# Altium schematic sheet Sheet3.SchDoc
size A
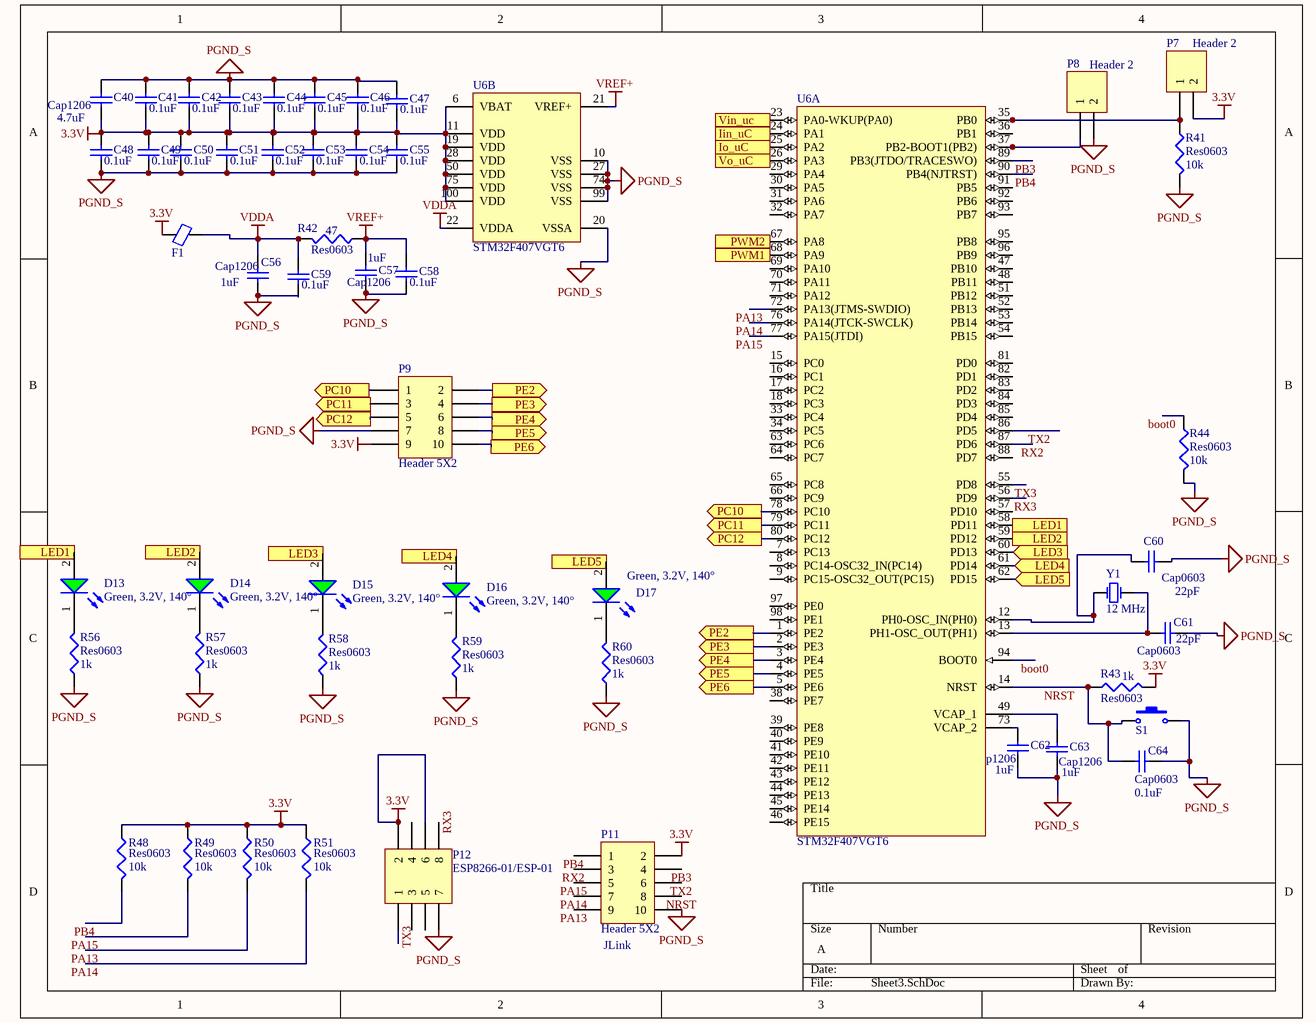
[diagram p0: Sheet3.SchDoc]

## Parts
C40  Cap1206  value 4.7uF  [C1206]
C41  value 0.1uF  [1608[0603]]  (hidden comment: Cap0603)
C42  value 0.1uF  [1608[0603]]  (hidden comment: Cap0603)
C43  value 0.1uF  [1608[0603]]  (hidden comment: Cap0603)
C44  value 0.1uF  [1608[0603]]  (hidden comment: Cap0603)
C45  value 0.1uF  [1608[0603]]  (hidden comment: Cap0603)
C46  value 0.1uF  [1608[0603]]  (hidden comment: Cap0603)
C47  value 0.1uF  [1608[0603]]  (hidden comment: Cap0603)
C48  value 0.1uF  [1608[0603]]  (hidden comment: Cap0603)
C49  value 0.1uF  [1608[0603]]  (hidden comment: Cap0603)
C50  value 0.1uF  [1608[0603]]  (hidden comment: Cap0603)
C51  value 0.1uF  [1608[0603]]  (hidden comment: Cap0603)
C52  value 0.1uF  [1608[0603]]  (hidden comment: Cap0603)
C53  value 0.1uF  [1608[0603]]  (hidden comment: Cap0603)
C54  value 0.1uF  [1608[0603]]  (hidden comment: Cap0603)
C55  value 0.1uF  [1608[0603]]  (hidden comment: Cap0603)
C56  Cap1206  value 1uF  [C1206]
C57  Cap1206  value 1uF  [C1206]
C58  value 0.1uF  [1608[0603]]  (hidden comment: Cap0603)
C59  value 0.1uF  [1608[0603]]  (hidden comment: Cap0603)
C60  Cap0603  value 22pF  [1608[0603]]
C61  Cap0603  value 22pF  [1608[0603]]
C62  Cap1206  value 1uF  [C1206]
C63  Cap1206  value 1uF  [C1206]
C64  Cap0603  value 0.1uF  [1608[0603]]
D13  Green, 3.2V, 140°  [WL-SMCW_0805_150080xx75000]
D14  Green, 3.2V, 140°  [WL-SMCW_0805_150080xx75000]
D15  Green, 3.2V, 140°  [WL-SMCW_0805_150080xx75000]
D16  Green, 3.2V, 140°  [WL-SMCW_0805_150080xx75000]
D17  Green, 3.2V, 140°  [WL-SMCW_0805_150080xx75000]
F1  Ferrite Bead SMD  [FB0805]  (value not drawn)
P7  Header 2  [HDR1X2]
P8  Header 2  [HDR1X2]
P9  Header 5X2  [HDR2X5]
P11  Header 5X2  [HDR2X5]
P12  ESP8266-01/ESP-01  [HDR2X4]
R41  Res0603  value 10k  [J1-0603]
R42  Res0603  value 47  [J1-0603]
R43  Res0603  value 1k  [J1-0603]
R44  Res0603  value 10k  [J1-0603]
R48  Res0603  value 10k  [J1-0603]
R49  Res0603  value 10k  [J1-0603]
R50  Res0603  value 10k  [J1-0603]
R51  Res0603  value 10k  [J1-0603]
R56  Res0603  value 1k  [J1-0603]
R57  Res0603  value 1k  [J1-0603]
R58  Res0603  value 1k  [J1-0603]
R59  Res0603  value 1k  [J1-0603]
R60  Res0603  value 1k  [J1-0603]
S1  Switch PB  [SW-PB]  (value not drawn)
U6  STM32F407VGT6  [STM-LQFP100_N]  (parts A,B of 2)
Y1  12 MHz  [XTAL 16MHZ]

## Ports
Iin_uC (in), Io_uC (in), LED1 (in), LED2 (in), LED3 (in), LED4 (in), LED5 (in), PC10 (out), PC11 (out), PC12 (out), PE2 (out), PE3 (out), PE4 (out), PE5 (out), PE6 (out), PWM1 (in), PWM2 (in), Vin_uc (in), Vo_uC (in)

## Nets
3.3V: C40.2 C41.2 C42.2 C43.2 C44.2 C45.2 C46.2 C47.2 C48.1 C49.1 C50.1 C51.1 C52.1 C53.1 C54.1 C55.1 F1.1 P7.2 P9.9 P11.2 P12.2 P12.6 R43.2 R48.1 R49.1 R50.1 R51.1 U6.6(VBAT) U6.11(VDD) U6.19(VDD) U6.28(VDD) U6.50(VDD) U6.75(VDD) U6.100(VDD)
PGND_S: C40.1 C41.1 C42.1 C43.1 C44.1 C45.1 C46.1 C47.1 C48.2 C49.2 C50.2 C51.2 C52.2 C53.2 C54.2 C55.2 C56.2 C57.2 C58.2 C59.2 C60.1 C61.1 C62.1 C63.1 C64.1 P8.2 P9.7 P11.10 P12.7 R41.2 R44.2 R56.1 R57.1 R58.1 R59.1 R60.1 S1.2 U6.10(VSS) U6.20(VSSA) U6.27(VSS) U6.74(VSS) U6.99(VSS)
VDDA: C56.1 C59.1 F1.2 R42.2 U6.22(VDDA)
VREF+: C57.1 C58.1 R42.1 U6.21(VREF+)
boot0: R44.1 U6.94(BOOT0)
Iin_uC: U6.24(PA1) ; port Iin_uC
Io_uC: U6.25(PA2) ; port Io_uC
LED1: D13.2(A) U6.58(PD11) ; port LED1
LED2: D14.2(A) U6.59(PD12) ; port LED2
LED3: D15.2(A) U6.60(PD13) ; port LED3
LED4: D16.2(A) U6.61(PD14) ; port LED4
LED5: D17.2(A) U6.62(PD15) ; port LED5
NRST: C64.2 P11.8 R43.1 S1.1 U6.14(NRST)
PA13: P11.9 R50.2 U6.72(PA13(JTMS-SWDIO))
PA14: P11.7 R51.2 U6.76(PA14(JTCK-SWCLK))
PA15: P11.5 R49.2 U6.77(PA15(JTDI))
PB3: P11.4 U6.89(PB3(JTDO/TRACESWO))
PB4: P11.1 R48.2 U6.90(PB4(NJTRST))
PC10: P9.1 U6.78(PC10) ; port PC10
PC11: P9.3 U6.79(PC11) ; port PC11
PC12: P9.5 U6.80(PC12) ; port PC12
PE2: P9.2 U6.1(PE2) ; port PE2
PE3: P9.4 U6.2(PE3) ; port PE3
PE4: P9.6 U6.3(PE4) ; port PE4
PE5: P9.8 U6.4(PE5) ; port PE5
PE6: P9.10 U6.5(PE6) ; port PE6
PWM1: U6.68(PA9) ; port PWM1
PWM2: U6.67(PA8) ; port PWM2
RX2: P11.3 U6.87(PD6)
RX3: P12.8 U6.56(PD9)
TX2: P11.6 U6.86(PD5)
TX3: P12.1 U6.55(PD8)
Vin_uc: U6.23(PA0-WKUP(PA0)) ; port Vin_uc
Vo_uC: U6.26(PA3) ; port Vo_uC
NetC60_2: C60.2 U6.12(PH0-OSC_IN(PH0)) Y1.1(OSC1)
NetC61_2: C61.2 U6.13(PH1-OSC_OUT(PH1)) Y1.2(OSC2)
NetC62_2: C62.2 U6.73(VCAP_2)
NetC63_2: C63.2 U6.49(VCAP_1)
NetD13_1: D13.1(K) R56.2
NetD14_1: D14.1(K) R57.2
NetD15_1: D15.1(K) R58.2
NetD16_1: D16.1(K) R59.2
NetD17_1: D17.1(K) R60.2
NetP7_1: P7.1 R41.1 U6.35(PB0)
NetP8_1: P8.1 U6.37(PB2-BOOT1(PB2))

Not connected (* = marked no-connect by the designer): P12 3 4 5; U6 7(PC13) 8(PC14-OSC32_IN(PC14)) 9(PC15-OSC32_OUT(PC15)) 15(PC0) 16(PC1) 17(PC2) 18(PC3) 29(PA4) 30(PA5) 31(PA6) 32(PA7) 33(PC4) 34(PC5) 36(PB1) 38(PE7) 39(PE8) 40(PE9) 41(PE10) 42(PE11) 43(PE12) 44(PE13) 45(PE14) 46(PE15) 47(PB10) 48(PB11) 51(PB12) 52(PB13) 53(PB14) 54(PB15) 57(PD10) 63(PC6) 64(PC7) 65(PC8) 66(PC9) 69(PA10) 70(PA11) 71(PA12) 81(PD0) 82(PD1) 83(PD2) 84(PD3) 85(PD4) 88(PD7) 91(PB5) 92(PB6) 93(PB7) 95(PB8) 96(PB9) 97(PE0) 98(PE1)

## Notes on the sheet
- (near P11) JLink

## Library data of the parts
C40 = Cap Semi: CAP, CERM, 4.7uF, 50V, +/-20%, X7R, 1206; Published: 8-Jun-2000; LatestRevisionDate: 29-May-2009; LatestRevisionNote: IPC-7351 Footprint Added.; PackageReference: C1206; Publisher: Altium Limited; PackageDescription: Chip Capacitor
C41-C55 C58 C59 C64 = Cap Semi: CAP, CERM, 0.1 uF, 50V, +/-20%, X7R, 0603; Published: 8-Jun-2000; LatestRevisionDate: 29-May-2009; LatestRevisionNote: IPC-7351 Footprint Added.; PackageReference: C0603; Publisher: Altium Limited; PackageDescription: Chip Capacitor
C56 C57 C62 C63 = Cap Semi: CAP, CERM, 1uF, 50V, +/-20%, X7R, 1206; Published: 8-Jun-2000; LatestRevisionDate: 29-May-2009; LatestRevisionNote: IPC-7351 Footprint Added.; PackageReference: C1206; Publisher: Altium Limited; PackageDescription: Chip Capacitor
C60 C61 = Cap Semi: CAP, CERM, 22 pF, 50V, +/-20%, X7R, 0603; Published: 8-Jun-2000; LatestRevisionDate: 29-May-2009; LatestRevisionNote: IPC-7351 Footprint Added.; PackageReference: C0603; Publisher: Altium Limited; PackageDescription: Chip Capacitor
D13-D17 = 150080GS75000: WL-SMCW Mono-color Chip LED Waterclear, SMT, size 0805, Green, 3.2V, 140°; Manufacturer: Wurth Elektronik; Case/Size Code: 0805; Chip Technology: InGaN; Dominant Wavelength: 525nm; Luminous Intensity: 450mcd; Peak Wavelength: 515nm; Manufacturer Part Number: 150080GS75000; Category: Signal LEDs; Match Code: WL-SMCW; ComponentLink1Description: Website Link; ComponentLink1URL: https://www.we-online.com/redexpert/article/150080GS75000?ad; ComponentLink2Description: Datasheet Link; ComponentLink2URL: https://www.we-online.com/redexpert/spec/150080GS75000?ad; Mount: Surface Mount; Operating Temperature Max: 85°C; Operating Temperature Min: -40°C; Packaging: Tape and Reel; Length: 2mm; Width: 1.25mm; Height: 0.7mm; Emitting Color: Green; Forward Voltage: 3.2V; Viewing Angle: 140°
F1 = Ferrite Bead SMD Package: Designer: Ali Hafizi
P7 P8 = Header 2: Header, 2-Pin; LatestRevisionDate: 17-Jul-2002; LatestRevisionNote: Re-released for DXP Platform.; Publisher: Altium Limited
P9 P11 = Header 5X2: Header, 5-Pin, Dual row; LatestRevisionDate: 17-Jul-2002; LatestRevisionNote: Re-released for DXP Platform.; Publisher: Altium Limited
P12 = Header 4X2: Header, 4-Pin, Dual row; LatestRevisionDate: 17-Jul-2002; LatestRevisionNote: Re-released for DXP Platform.; Publisher: Altium Limited
R41 R44 R48-R51 = Res3: RES, 10 k ohm, 1%, 0.1W, 0603; Published: 8-Jun-2000; LatestRevisionDate: 29-May-2009; LatestRevisionNote: IPC-7351 Footprint Added.; PackageReference: J1-0603; Publisher: Altium Limited; PackageDescription: Chip Resistor
R42 = Res3: RES, 47 ohm, 1%, 0.1W, 0603; Published: 8-Jun-2000; LatestRevisionDate: 29-May-2009; LatestRevisionNote: IPC-7351 Footprint Added.; PackageReference: J1-0603; Publisher: Altium Limited; PackageDescription: Chip Resistor
R43 = Res3: RES, 1 k ohm, 1%, 0.1W, 0603; Published: 8-Jun-2000; LatestRevisionDate: 29-May-2009; LatestRevisionNote: IPC-7351 Footprint Added.; PackageReference: J1-0603; Publisher: Altium Limited; PackageDescription: Chip Resistor
R56-R60 = Res3: RES, 1k ohm, 1%, 0.1W, 0603; Published: 8-Jun-2000; LatestRevisionDate: 29-May-2009; LatestRevisionNote: IPC-7351 Footprint Added.; PackageReference: J1-0603; Publisher: Altium Limited; PackageDescription: Chip Resistor
S1 = Switch PB: Push Button Switch
U6 = STM32F407VGT6: ARM Cortex-M4 32-bit MCU+FPU, 210 DMIPS, 1024 kB Flash, 192 kB Internal RAM, 82 I/Os, 100-pin LQFP, -40 to 85 degC, Tray; Manufacturer: STMicroelectronics; D/A Converter: 2x12-bit; FLASH Size (Prog) (kB): 1024; I/Os (High Current): 82; Internal RAM Size (kB): 192; Operating Frequency(F) (Processor speed) (MHz): 168; Supply Voltage(Vcc) max (V): 3.6; Supply Voltage(Vcc) min (V): 1.8; DatasheetVersion: Rev. 4; PackageVersion: Rev. 1, 06/2013; PackageReference: LQFP100; PackageDescription: 100-Pin Low Profile Quad Flat Package, 14 x 14 mm Body, 0.5 mm Pitch; Supplier 1: Digi-Key; Supplier Part Number 1: 497-11605-ND; Supplier 2: Farnell; Supplier Part Number 2: 2064368; Supplier 3: Newark; Supplier Part Number 3: 73T2333; Supplier 4: Mouser; Supplier Part Number 4: 511-STM32F407VGT6; Core: ARM Cortex-M4; Packing: Tray; Mounting Technology: Surface Mount; PartNumber: STM32F407VGT6; ComponentLink1Description: Manufacturer URL; ComponentLink1URL: http://www.st.com/web/en/home.html; ComponentLink2Description: Datasheet; ComponentLink2URL: http://www.st.com/st-web-ui/static/active/en/resource/technical/document/datasheet/DM00037051.pdf; ComponentLink3Description: Package Specification; ComponentLink3URL: http://www.st.com/st-web-ui/static/active/en/resource/technical/document/data_brief/DM00071938.pdf
Y1 = XTAL: XTAL Crystal; Designer: ABBAS BASEREH; Design Date: 2017-1-3; ComponentLink1Description: Datasheet; ComponentLink2Description: Reference; Mounting Technology: Surface Mount\Through-Hole; Value: 12 MHz; Status: Unreleased